# Altium project PRL_PDC.PrjPcb (part 2 of 2)

## Sheet MCU.SchDoc
size 193 x 146 mm; DocumentNumber: 11; SheetNumber: 11; SheetTotal: 11
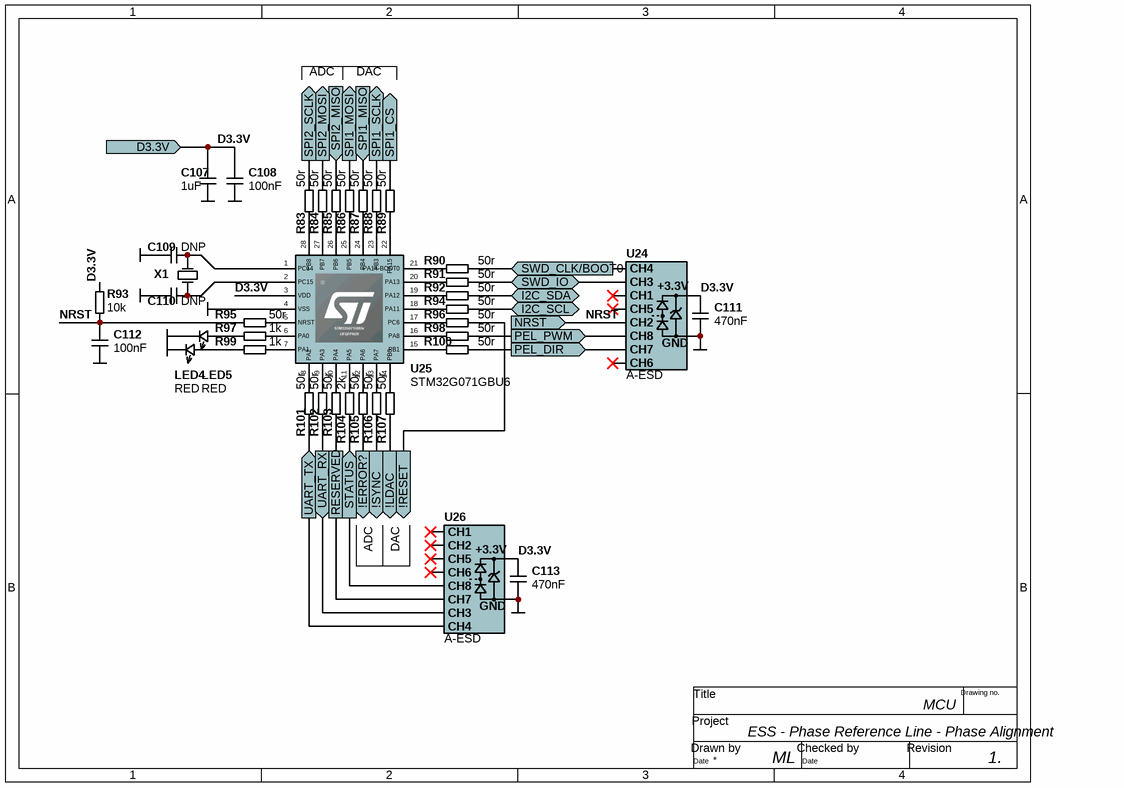
[diagram p8: MCU.SchDoc]

### Parts
C107  1uF  [0805-Capacitor]
C108  100nF  [0402-Capacitor]
C109  DNP  [0402-Capacitor]  (no BOM)
C110  DNP  [0402-Capacitor]  (no BOM)
C111  470nF  [0402-Capacitor]
C112  100nF  [0402-Capacitor]
C113  470nF  [0402-Capacitor]
LED4  RED  [LED0603]
LED5  RED  [LED0603]
R83  50r  [0402-RESISTOR]
R84  50r  [0402-RESISTOR]
R85  50r  [0402-RESISTOR]
R86  50r  [0402-RESISTOR]
R87  50r  [0402-RESISTOR]
R88  50r  [0402-RESISTOR]
R89  50r  [0402-RESISTOR]
R90  50r  [0402-RESISTOR]
R91  50r  [0402-RESISTOR]
R92  50r  [0402-RESISTOR]
R93  10k  [0402-RESISTOR]
R94  50r  [0402-RESISTOR]
R95  50r  [0402-RESISTOR]
R96  50r  [0402-RESISTOR]
R97  1k  [0402-RESISTOR]
R98  50r  [0402-RESISTOR]
R99  1k  [0402-RESISTOR]
R100  50r  [0402-RESISTOR]
R101  50r  [0402-RESISTOR]
R102  50r  [0402-RESISTOR]
R103  50r  [0402-RESISTOR]
R104  2k  [0402-RESISTOR]
R105  50r  [0402-RESISTOR]
R106  50r  [0402-RESISTOR]
R107  50r  [0402-RESISTOR]
U24  A-ESD  [MSOP10 3x3mm]
U25  STM32G071GBU6  [UFQFPN-28]
U26  A-ESD  [MSOP10 3x3mm]
X1  32.768KHz  [2-SMD-XTAL]  (value not drawn)

### Ports
!ERROR? (out), !LDAC (out), !RESET (out), !SYNC (out), D3.3V (in), I2C_SCL (bidir), I2C_SDA (bidir), NRST (in), PEL_DIR (out), PEL_PWM (out), RESERVED, SPI1_CS (out), SPI1_MISO (in), SPI1_MOSI (out), SPI1_SCLK (out), SPI2_MISO (in), SPI2_MOSI (out), SPI2_SCLK (out), STATUS (out), SWD_CLK/BOOT0 (in), SWD_IO (bidir), UART_RX (in), UART_TX (out)

### Nets
D3.3V: C107.1 C108.1 C111.1 C113.1 R93.2 U24.8(VP) U25.3(VDD) U26.8(VP) ; port D3.3V
DGND: C107.2 C108.2 C109.1 C110.1 C111.2 C112.2 C113.2 LED4.K LED5.K U24.5(VN) U25.4(VSS) U26.5(VN)
NRST: C112.1 R93.1 R95.2 U24.2(CH2) ; port NRST
PEL_DIR: R100.1 U24.9(CH7) ; port PEL_DIR
PEL_PWM: R98.1 U24.10(CH8) ; port PEL_PWM
RESERVED: R103.1 U26.9(CH7) ; port RESERVED
STATUS: R104.1 U26.10(CH8) ; port STATUS
UART_RX: R102.1 U26.3(CH3) ; port UART_RX
UART_TX: R101.1 U26.4(CH4) ; port UART_TX
NetC109_2: C109.2 U25.1(PC14) X1.2(OSC2)
NetC110_2: C110.2 U25.2(PC15) X1.1(OSC1)
NetJ2_2: R90.1 U24.4(CH4) ; port SWD_CLK/BOOT0
NetJ2_4: R91.1 U24.3(CH3) ; port SWD_IO
NetLED4_A: LED4.A R99.1
NetLED5_A: LED5.A R97.1
NetR23_2: R96.1 ; port !RESET
NetR83_1: R83.1 ; port SPI2_SCLK
NetR83_2: R83.2 U25.28(PB8)
NetR84_1: R84.1 ; port SPI2_MOSI
NetR84_2: R84.2 U25.27(PB7)
NetR85_1: R85.1 ; port SPI2_MISO
NetR85_2: R85.2 U25.26(PB6)
NetR86_1: R86.1 ; port SPI1_MOSI
NetR86_2: R86.2 U25.25(PB5)
NetR87_1: R87.1 ; port SPI1_MISO
NetR87_2: R87.2 U25.24(PB4)
NetR88_1: R88.1 ; port SPI1_SCLK
NetR88_2: R88.2 U25.23(PB3)
NetR89_1: R89.1 ; port SPI1_CS
NetR89_2: R89.2 U25.22(PA15)
NetR90_2: R90.2 U25.21(PA14-BOOT0)
NetR91_2: R91.2 U25.20(PA13)
NetR92_1: R92.1 ; port I2C_SDA
NetR92_2: R92.2 U25.19(PA12)
NetR94_1: R94.1 ; port I2C_SCL
NetR94_2: R94.2 U25.18(PA11)
NetR95_1: R95.1 U25.5(NRST)
NetR96_2: R96.2 U25.17(PC6)
NetR97_2: R97.2 U25.6(PA0)
NetR98_2: R98.2 U25.16(PA8)
NetR99_2: R99.2 U25.7(PA1)
NetR100_2: R100.2 U25.15(PB1)
NetR101_2: R101.2 U25.8(PA2)
NetR102_2: R102.2 U25.9(PA3)
NetR103_2: R103.2 U25.10(PA4)
NetR104_2: R104.2 U25.11(PA5)
NetR105_1: R105.1 ; port !ERROR?
NetR105_2: R105.2 U25.12(PA6)
NetR106_1: R106.1 ; port !SYNC
NetR106_2: R106.2 U25.13(PA7)
NetR107_1: R107.1 ; port !LDAC
NetR107_2: R107.2 U25.14(PB0)

Not connected (* = marked no-connect by the designer): U24 1(CH1)* 6(CH5)* 7(CH6)*; U26 1(CH1)* 2(CH2)* 6(CH5)* 7(CH6)*

### Notes on the sheet
- ADC
- DAC
- (near U26) DAC
- ESS - Phase Reference Line - Phase Alignment
- MCU
- ML
- 1.
- Title
- Project
- Drawing no.
- Date
- Drawn by
- Checked by
- Revision
- (in symbol CM1213-08MR) +3.3V; GND

### Library data of the parts
C107 = C_0805: Capacitor 0805; Tolerance: ±20%; Voltage Rating: 16V; Dielectric: X7R/C0G; Value: 1uF; Case: 0805
C108 C111-C113 = C_0402: Capacitor 0402; Tolerance: ±20%; Voltage Rating: 16V; Dielectric: X7R/C0G; Case: 0402
  C108 C112: Value: 100nF
  C111 C113: Value: 470nF
C109 C110 = C_0402: Capacitor 0402; Value: 4pF; Tolerance: ±20%; Voltage Rating: 16V; Dielectric: X7R/C0G; Case: 0402
LED4 LED5 = LED0603: Color: Red; Case: 0603
R83-R107 = R_0402: Resistor 0402; Tolerance: ±1%; Case: 0402
  R83-R92 R94-R96 R98 R100-R103 R105-R107: Value: 50r
  R93: Value: 10k
  R97 R99: Value: 1k
  R104: Value: 2k
U24 U26 = CM1213-08MR: 8-Channel / Low Capacitance ESD / Protection Array; HelpURL: https://www.onsemi.com/pub/Collateral/CM1213-D.PDF; Case: 10-MSOP; Supplier 1: Digi-Key; Supplier Part Number 1: CM1213-08MROSCT-ND
U25 = STM32G071GBU6: IC MCU 32BIT 128KB FLASH 28QFPN; HelpURL: https://media.digikey.com/pdf/Data%20Sheets/ST%20Microelectronics%20PDFS/STM32G071_Rev1_DS.pdf; Case: 28-UFQFPN; Supplier 1: Digi-Key; Supplier Part Number 1: 497-18343-ND
X1 = XTAL_ABS07-120-32.768KHZ-T: 32.768kHz ±20ppm Crystal 6pF 55 kOhms 2-SMD, No Lead; HelpURL: https://abracon.com/Resonators/ABS07-120-32.768kHz-T.pdf; Case: 2-SMD; Supplier 1: Digi-Key; Supplier Part Number 1: 535-11937-1-ND; Value: 32.768KHz

## Sheet Isolator.SchDoc
size 193 x 146 mm; DocumentNumber: 8; SheetNumber: 8; SheetTotal: 11
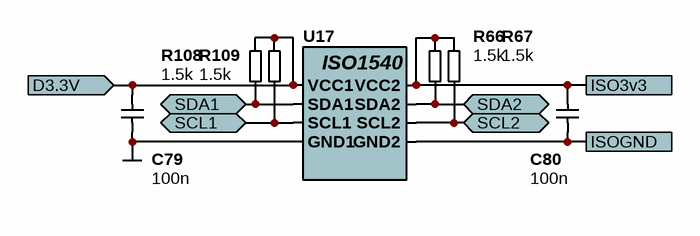
[diagram p9: Isolator.SchDoc]

### Parts
C79  100n  [0402-Capacitor]  (net tie, no BOM)
C80  100n  [0402-Capacitor]  (net tie, no BOM)
R66  1.5k  [0603-RESISTOR]
R67  1.5k  [0603-RESISTOR]
R108  1.5k  [0603-RESISTOR]
R109  1.5k  [0603-RESISTOR]
U17  ISO1540DR  [SOIC8]  (value not drawn)

### Ports
D3.3V (in), ISO3v3, ISOGND, SCL1 (bidir), SCL2 (bidir), SDA1 (bidir), SDA2 (bidir)

### Nets
D3.3V: C79.2 R108.1 R109.1 U17.1(VCC1) ; port D3.3V
DGND: C79.1 U17.4(GND1)
NetC80_1: C80.1 U17.5(GND2) ; port ISOGND
NetC80_2: C80.2 R66.1 R67.1 U17.8(VCC2) ; port ISO3v3
NetJ1_7: R67.2 U17.6(SCL2) ; port SCL2
NetJ1_15: R66.2 U17.7(SDA2) ; port SDA2
NetR92_1: R108.2 U17.2(SDA1) ; port SDA1
NetR94_1: R109.2 U17.3(SCL1) ; port SCL1

### Notes on the sheet
- Title
- Project
- Drawing no.
- Date
- Drawn by
- Checked by
- Revision
- (in symbol ISO1540DR) ISO1540

### Library data of the parts
C79 C80 = C_0402: as C108 on sheet MCU; Value: 100n; Case: 0402
R66 R67 R108 R109 = R_0603: Resistor 0603; Tolerance: ±1%; Value: 1.5k; Case: 0603
U17 = ISO1540DR: 12 Weeks / Detailed Description I²C Digital Isolator 2500Vrms 2 Channel 1Mbps 25kV/µs CMTI 8-SOIC (0.154", 3.90mm Width); HelpURL: http://www.ti.com/lit/ds/symlink/iso1540.pdf; Case: 8-SOIC; Supplier 1: Digi-Key; Supplier Part Number 1: 296-34871-1-ND

## Sheet OffsetAmplifier.SchDoc
size 193 x 146 mm; DocumentNumber: 7; SheetNumber: 7; SheetTotal: 11
Used 2 times, as channels OffsetAmp704, OffsetAmp352. Parts and nets are listed once, with the designators drawn on the sheet.
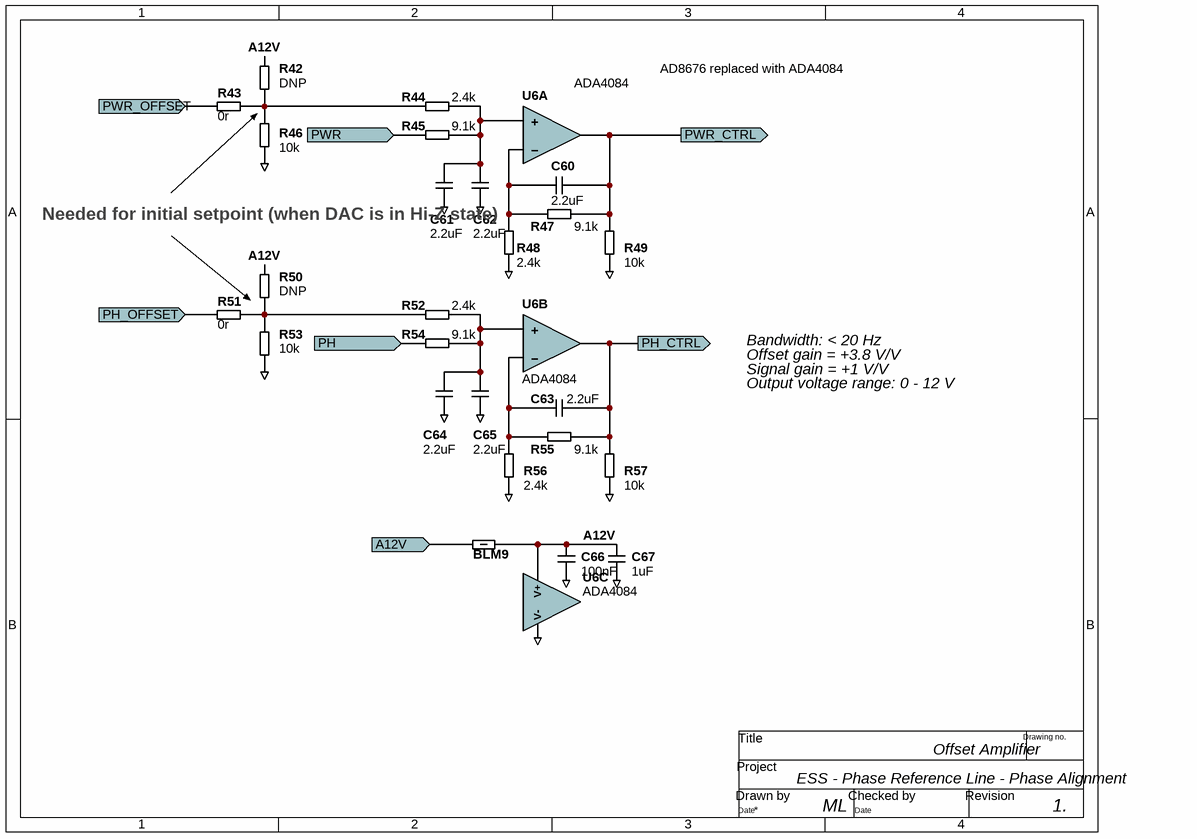
[diagram p10: OffsetAmplifier.SchDoc]

### Parts
BLM9  120 Ohms @ 100MHz  [0402-Inductor]  (value not drawn)
C60  2.2uF  [0805-Capacitor]
C61  2.2uF  [0805-Capacitor]
C62  2.2uF  [0805-Capacitor]
C63  2.2uF  [0805-Capacitor]
C64  2.2uF  [0805-Capacitor]
C65  2.2uF  [0805-Capacitor]
C66  100nF  [0402-Capacitor]
C67  1uF  [0805-Capacitor]
R42  DNP  [0402-RESISTOR]  (no BOM)
R43  0r  [0402-RESISTOR]
R44  2.4k  [0402-RESISTOR]
R45  9.1k  [0402-RESISTOR]
R46  10k  [0402-RESISTOR]
R47  9.1k  [0402-RESISTOR]
R48  2.4k  [0402-RESISTOR]
R49  10k  [0402-RESISTOR]
R50  DNP  [0402-RESISTOR]  (no BOM)
R51  0r  [0402-RESISTOR]
R52  2.4k  [0402-RESISTOR]
R53  10k  [0402-RESISTOR]
R54  9.1k  [0402-RESISTOR]
R55  9.1k  [0402-RESISTOR]
R56  2.4k  [0402-RESISTOR]
R57  10k  [0402-RESISTOR]
U6  ADA4084  [SOIC8]  (parts A,B,C of 3)

### Ports
A12V (in), PH (in), PH_CTRL (out), PH_OFFSET (in), PWR (in), PWR_CTRL (out), PWR_OFFSET (in)

### Nets
GND: C61.2 C62.2 C64.2 C65.2 C66.2 C67.2 R46.1 R48.1 R49.1 R53.1 R56.1 R57.1 U6.4(V-)
A12V: BLM9.1 C66.1 C67.1 R42.2 R50.2 U6.8(V+)  [project net A12V_7]
A12V: BLM9.2 ; port A12V  [a separate net that carries the same name]
PH: R54.1 ; port PH
PH_CTRL: C63.2 R55.2 R57.2 U6.7(BOut) ; port PH_CTRL
PH_OFFSET: R51.1 ; port PH_OFFSET
PWR: R45.1 ; port PWR
PWR_CTRL: C60.2 R47.2 R49.2 U6.1(Aout) ; port PWR_CTRL
PWR_OFFSET: R43.1 ; port PWR_OFFSET
NetC60_1: C60.1 R47.1 R48.2 U6.2(-A)
NetC61_1: C61.1 C62.1 R44.2 R45.2 U6.3(+A)
NetC63_1: C63.1 R55.1 R56.2 U6.6(-B)
NetC64_1: C64.1 C65.1 R52.2 R54.2 U6.5(+B)
NetR42_1: R42.1 R43.2 R44.1 R46.2
NetR50_1: R50.1 R51.2 R52.1 R53.2

### Channels
OffsetAmp704: designators end in _OffsetAmp704; ports A12V=A12V PH=B PH_CTRL=PhaseControl_704 PH_OFFSET=C PWR=A PWR_CTRL=PowerControl_704 PWR_OFFSET=D
OffsetAmp352: designators end in _OffsetAmp352; ports A12V=A12V PH=G PH_CTRL=PhaseControl_352 PH_OFFSET=H PWR=F PWR_CTRL=PowerControl_352 PWR_OFFSET=E

### Notes on the sheet
- AD8676 replaced with ADA4084
- Needed for initial setpoint (when DAC is in Hi-Z state)
- Bandwidth: < 20 Hz
- Offset gain = +3.8 V/V
- Signal gain = +1 V/V
- Output voltage range: 0 - 12 V
- ESS - Phase Reference Line - Phase Alignment
- Offset Amplifier
- ML
- 1.
- Title
- Project
- Drawing no.
- Date
- Drawn by
- Checked by
- Revision

### Library data of the parts
BLM9 = BLM15AX121SZ1D: 120 Ohms @ 100MHz 1 Power, Signal Line Ferrite Bead 0402 (1005 Metric) 700mA 130mOhm; Case: 0402; Supplier 1: Digi-Key; Supplier Part Number 1: 490-16510-1-ND; HelpURL: https://www.murata.com/en-us/products/productdata/8796748677150/QNFA9118.pdf
C60-C65 C67 = C_0805: as C107 on sheet MCU; Case: 0805
  C60-C65: Value: 2.2uF
  C67: Value: 1uF
C66 = C_0402: as C108 on sheet MCU; Value: 100nF; Case: 0402
R42 R50 = R_0402: Resistor 0402; Value: 10k; Tolerance: ±1%; Case: 0402
R43-R49 R51-R57 = R_0402: Resistor 0402; Tolerance: ±1%; Case: 0402
  R43 R51: Value: 0r
  R44 R48 R52 R56: Value: 2.4k
  R45 R47 R54 R55: Value: 9.1k
  R46 R49 R53 R57: Value: 10k
U6 = ADA4084: DUAL OP AMP; HelpURL: https://www.analog.com/media/en/technical-documentation/data-sheets/ADA4084-1_4084-2_4084-4.pdf; Supplier 1: Digi-Key; Supplier Part Number 1: ADA4084-2ARZ

## Nets that join several sheets
A5V: RF (BLM12.2 BLM15.2), PD2/A3.3V_PhD (C81_PD2_A3.3V_PhD.1 U18_PD2_A3.3V_PhD.1 U18_PD2_A3.3V_PhD.3), PD1/A3.3V_PhD (C81_PD1_A3.3V_PhD.1 U18_PD1_A3.3V_PhD.1 U18_PD1_A3.3V_PhD.3), PD3/A3.3V_PhD (C81_PD3_A3.3V_PhD.1 U18_PD3_A3.3V_PhD.1 U18_PD3_A3.3V_PhD.3), PD0/A3.3V_PhD (C81_PD0_A3.3V_PhD.1 U18_PD0_A3.3V_PhD.1 U18_PD0_A3.3V_PhD.3), Frequency Divider/A3.3V_FD (C81_A3.3V_FD.1 U18_A3.3V_FD.1 U18_A3.3V_FD.3), PD4/A3.3V_PhD (C81_PD4_A3.3V_PhD.1 U18_PD4_A3.3V_PhD.1 U18_PD4_A3.3V_PhD.3), DAC (BLM7.1), PWD0/A3.3V_PD (C81_PWD0_A3.3V_PD.1 U18_PWD0_A3.3V_PD.1 U18_PWD0_A3.3V_PD.3), PWD1/A3.3V_PD (C81_PWD1_A3.3V_PD.1 U18_PWD1_A3.3V_PD.1 U18_PWD1_A3.3V_PD.3), PWD2/A3.3V_PD (C81_PWD2_A3.3V_PD.1 U18_PWD2_A3.3V_PD.1 U18_PWD2_A3.3V_PD.3), PWD3/A3.3V_PD (C81_PWD3_A3.3V_PD.1 U18_PWD3_A3.3V_PD.1 U18_PWD3_A3.3V_PD.3), Power (7 pins), A3.3V_ADC (C81_A3.3V_ADC.1 U18_A3.3V_ADC.1 U18_A3.3V_ADC.3)
A12V: Power (15 pins), OffsetAmp704 (BLM9_OffsetAmp704.2), OffsetAmp352 (BLM9_OffsetAmp352.2)
D3.3V: RF (J1.12 J2.1), DAC (C46.2 C47.1 R23.1 U4.2), ADC (C21.1 C22.2 U3.20), Power (7 pins), MCU (8 pins), Isolator (C79.2 R108.1 R109.1 U17.1)
DGND: RF (148 pins), PD2 (11 pins), PD2/A3.3V_PhD (C81_PD2_A3.3V_PhD.2 C82_PD2_A3.3V_PhD.2 R70_PD2_A3.3V_PhD.1 U18_PD2_A3.3V_PhD.2), PD1 (11 pins), PD1/A3.3V_PhD (C81_PD1_A3.3V_PhD.2 C82_PD1_A3.3V_PhD.2 R70_PD1_A3.3V_PhD.1 U18_PD1_A3.3V_PhD.2), PD3 (11 pins), PD3/A3.3V_PhD (C81_PD3_A3.3V_PhD.2 C82_PD3_A3.3V_PhD.2 R70_PD3_A3.3V_PhD.1 U18_PD3_A3.3V_PhD.2), PD0 (11 pins), PD0/A3.3V_PhD (C81_PD0_A3.3V_PhD.2 C82_PD0_A3.3V_PhD.2 R70_PD0_A3.3V_PhD.1 U18_PD0_A3.3V_PhD.2), FreqDiv (29 pins), Frequency Divider/A3.3V_FD (C81_A3.3V_FD.2 C82_A3.3V_FD.2 R70_A3.3V_FD.1 U18_A3.3V_FD.2), PD4 (11 pins), PD4/A3.3V_PhD (C81_PD4_A3.3V_PhD.2 C82_PD4_A3.3V_PhD.2 R70_PD4_A3.3V_PhD.1 U18_PD4_A3.3V_PhD.2), DAC (8 pins), ADC (44 pins), PWD0 (11 pins), PWD0/A3.3V_PD (C81_PWD0_A3.3V_PD.2 C82_PWD0_A3.3V_PD.2 R70_PWD0_A3.3V_PD.1 U18_PWD0_A3.3V_PD.2), PWD1 (11 pins), PWD1/A3.3V_PD (C81_PWD1_A3.3V_PD.2 C82_PWD1_A3.3V_PD.2 R70_PWD1_A3.3V_PD.1 U18_PWD1_A3.3V_PD.2), PWD2 (11 pins), PWD2/A3.3V_PD (C81_PWD2_A3.3V_PD.2 C82_PWD2_A3.3V_PD.2 R70_PWD2_A3.3V_PD.1 U18_PWD2_A3.3V_PD.2), PWD3 (11 pins), PWD3/A3.3V_PD (C81_PWD3_A3.3V_PD.2 C82_PWD3_A3.3V_PD.2 R70_PWD3_A3.3V_PD.1 U18_PWD3_A3.3V_PD.2), Power (23 pins), MCU (12 pins), Isolator (C79.1 U17.4), A3.3V_ADC (C81_A3.3V_ADC.2 C82_A3.3V_ADC.2 R70_A3.3V_ADC.1 U18_A3.3V_ADC.2), OffsetAmp704 (13 pins), OffsetAmp352 (13 pins)
A: DAC (U4.19), OffsetAmp704 (R45_OffsetAmp704.1)
A3.3V_ADC: RF (C77.2 U12.5), ADC (BLM2.1 BLM3.1 BLM4.1), A3.3V_ADC (C82_A3.3V_ADC.1 LED1_A3.3V_ADC.A U18_A3.3V_ADC.4 U18_A3.3V_ADC.5)
AMP352: RF (R142.2 R143.2), PD3 (C4_PD3.1 R1_PD3.2)
AMP352_P: ADC (R14.1), PWD2 (R63_PWD2.2 R64_PWD2.1)
AMP704: RF (R129.2 R130.2), PD1 (C8_PD1.1 R3_PD1.1)
AMP704_P: ADC (R16.1), PWD1 (R63_PWD1.2 R64_PWD1.1)
B: DAC (U4.6), OffsetAmp704 (R54_OffsetAmp704.1)
C: DAC (U4.7), OffsetAmp704 (R51_OffsetAmp704.1)
D: DAC (U4.20), OffsetAmp704 (R43_OffsetAmp704.1)
E: DAC (U4.17), OffsetAmp352 (R43_OffsetAmp352.1)
F: DAC (U4.18), OffsetAmp352 (R45_OffsetAmp352.1)
G: DAC (U4.8), OffsetAmp352 (R54_OffsetAmp352.1)
H: DAC (U4.9), OffsetAmp352 (R51_OffsetAmp352.1)
MO352_1: RF (R140.2 R145.2), PD3 (C8_PD3.1 R3_PD3.1)
MO352_2: RF (R135.2 R136.2), PD0 (C4_PD0.1 R1_PD0.2)
MO352_3: RF (R138.2 R139.2), PD4 (C4_PD4.1 R1_PD4.2)
MO352_P: ADC (R21.1), PWD3 (R63_PWD3.2 R64_PWD3.1)
MO704: RF (R127.1 R128.2), PD1 (C4_PD1.1 R1_PD1.2)
MO704/2: RF (LPF2.3), PD0 (C8_PD0.1 R3_PD0.1)
MO704_P: ADC (R9.1), PWD0 (R63_PWD0.2 R64_PWD0.1)
NetBLM1_PD0_1: PD0 (BLM1_PD0.1), PD0/A3.3V_PhD (C82_PD0_A3.3V_PhD.1 LED1_PD0_A3.3V_PhD.A U18_PD0_A3.3V_PhD.4 U18_PD0_A3.3V_PhD.5)
NetBLM1_PD1_1: PD1 (BLM1_PD1.1), PD1/A3.3V_PhD (C82_PD1_A3.3V_PhD.1 LED1_PD1_A3.3V_PhD.A U18_PD1_A3.3V_PhD.4 U18_PD1_A3.3V_PhD.5)
NetBLM1_PD2_1: PD2 (BLM1_PD2.1), PD2/A3.3V_PhD (C82_PD2_A3.3V_PhD.1 LED1_PD2_A3.3V_PhD.A U18_PD2_A3.3V_PhD.4 U18_PD2_A3.3V_PhD.5)
NetBLM1_PD3_1: PD3 (BLM1_PD3.1), PD3/A3.3V_PhD (C82_PD3_A3.3V_PhD.1 LED1_PD3_A3.3V_PhD.A U18_PD3_A3.3V_PhD.4 U18_PD3_A3.3V_PhD.5)
NetBLM1_PD4_1: PD4 (BLM1_PD4.1), PD4/A3.3V_PhD (C82_PD4_A3.3V_PhD.1 LED1_PD4_A3.3V_PhD.A U18_PD4_A3.3V_PhD.4 U18_PD4_A3.3V_PhD.5)
NetBLM8_2: FreqDiv (BLM8.2), Frequency Divider/A3.3V_FD (C82_A3.3V_FD.1 LED1_A3.3V_FD.A U18_A3.3V_FD.4 U18_A3.3V_FD.5)
NetBLM10_PWD0_2: PWD0 (BLM10_PWD0.2), PWD0/A3.3V_PD (C82_PWD0_A3.3V_PD.1 LED1_PWD0_A3.3V_PD.A U18_PWD0_A3.3V_PD.4 U18_PWD0_A3.3V_PD.5)
NetBLM10_PWD1_2: PWD1 (BLM10_PWD1.2), PWD1/A3.3V_PD (C82_PWD1_A3.3V_PD.1 LED1_PWD1_A3.3V_PD.A U18_PWD1_A3.3V_PD.4 U18_PWD1_A3.3V_PD.5)
NetBLM10_PWD2_2: PWD2 (BLM10_PWD2.2), PWD2/A3.3V_PD (C82_PWD2_A3.3V_PD.1 LED1_PWD2_A3.3V_PD.A U18_PWD2_A3.3V_PD.4 U18_PWD2_A3.3V_PD.5)
NetBLM10_PWD3_2: PWD3 (BLM10_PWD3.2), PWD3/A3.3V_PD (C82_PWD3_A3.3V_PD.1 LED1_PWD3_A3.3V_PD.A U18_PWD3_A3.3V_PD.4 U18_PWD3_A3.3V_PD.5)
NetC8_PD2_1: RF (R121.2 R122.2), PD2 (C8_PD2.1 R3_PD2.1)
NetC71_PWD0_1: RF (R124.2 R125.2), PWD0 (C71_PWD0.1 C72_PWD0.1)
NetC71_PWD1_1: RF (R133.2 R134.2), PWD1 (C71_PWD1.1 C72_PWD1.1)
NetC71_PWD2_1: RF (R148.2 R149.2), PWD2 (C71_PWD2.1 C72_PWD2.1)
NetC71_PWD3_1: RF (R151.2 R152.2), PWD3 (C71_PWD3.1 C72_PWD3.1)
NetC80_1: RF (J1.14), Isolator (C80.1 U17.5)
NetC80_2: RF (J1.8), Isolator (C80.2 R66.1 R67.1 U17.8)
NetJ1_7: RF (J1.7), Isolator (R67.2 U17.6)
NetJ1_15: RF (J1.15), Isolator (R66.2 U17.7)
NetJ2_2: RF (J2.2 R162.2), MCU (R90.1 U24.4)
NetJ2_4: RF (J2.4), MCU (R91.1 U24.3)
NetLPF2_1: RF (LPF2.1), FreqDiv (R112.2 R113.2)
NetR23_2: DAC (R23.2 U4.14), MCU (R96.1)
NetR83_1: ADC (U3.16), MCU (R83.1)
NetR84_1: ADC (U3.15), MCU (R84.1)
NetR85_1: ADC (U3.14), MCU (R85.1)
NetR86_1: DAC (U4.5), MCU (R86.1)
NetR87_1: DAC (U4.13), MCU (R87.1)
NetR88_1: DAC (U4.4), MCU (R88.1)
NetR89_1: DAC (U4.3), MCU (R89.1)
NetR92_1: MCU (R92.1), Isolator (R108.2 U17.2)
NetR94_1: MCU (R94.1), Isolator (R109.2 U17.3)
NetR105_1: ADC (U3.18), MCU (R105.1)
NetR106_1: ADC (U3.19), MCU (R106.1)
NetR107_1: DAC (U4.12), MCU (R107.1)
NetSplt2_9: RF (Splt2.9), FreqDiv (T1.4)
NRST: RF (J2.5), MCU (C112.1 R93.1 R95.2 U24.2)
PD0MAG: PD0 (R2_PD0.1), ADC (R18.1)
PD0PHS: PD0 (R4_PD0.1), ADC (R17.1)
PD1MAG: PD1 (R2_PD1.1), ADC (R10.1)
PD1PHS: PD1 (R4_PD1.1), ADC (R11.1)
PD2MAG: PD2 (R2_PD2.1), ADC (R6.1)
PD2PHS: PD2 (R4_PD2.1), ADC (R5.1)
PD3MAG: PD3 (R2_PD3.1), ADC (R19.1)
PD3PHS: PD3 (R4_PD3.1), ADC (R20.1)
PD4MAG: PD4 (R2_PD4.1), ADC (R8.1)
PD4PHS: PD4 (R4_PD4.1), ADC (R7.1)
PEL_DIR: RF (J1.5), MCU (R100.1 U24.9)
PEL_PWM: RF (J1.13), MCU (R98.1 U24.10)
PhaseControl_352: RF (BLM16.2), OffsetAmp352 (C63_OffsetAmp352.2 R55_OffsetAmp352.2 R57_OffsetAmp352.2 U6_OffsetAmp352.7)
PhaseControl_704: RF (BLM13.1), OffsetAmp704 (C63_OffsetAmp704.2 R55_OffsetAmp704.2 R57_OffsetAmp704.2 U6_OffsetAmp704.7)
PowerControl_352: RF (BLM14.2), OffsetAmp352 (C60_OffsetAmp352.2 R47_OffsetAmp352.2 R49_OffsetAmp352.2 U6_OffsetAmp352.1)
PowerControl_704: RF (BLM11.1), OffsetAmp704 (C60_OffsetAmp704.2 R47_OffsetAmp704.2 R49_OffsetAmp704.2 U6_OffsetAmp704.1)
PWR+: RF (J1.1), Power (D1.1)
PWR-: RF (J1.9), Power (C91.- C92.- D2.A L1.4)
RESERVED: RF (J1.11), MCU (R103.1 U26.9)
RH: RF (U12.1), ADC (R13.1)
STATUS: RF (J1.4), MCU (R104.1 U26.10)
STUB352: RF (R115.2 R116.2), PD4 (C8_PD4.1 R3_PD4.1)
STUB704: RF (R118.2 R119.2), PD2 (C4_PD2.1 R1_PD2.2)
T: RF (U12.4), ADC (R12.1)
UART_RX: RF (J1.10), MCU (R102.1 U26.3)
UART_TX: RF (J1.2), MCU (R101.1 U26.4)